# EAGLE design PixelController_V04 (EAGLE 8.0.0)
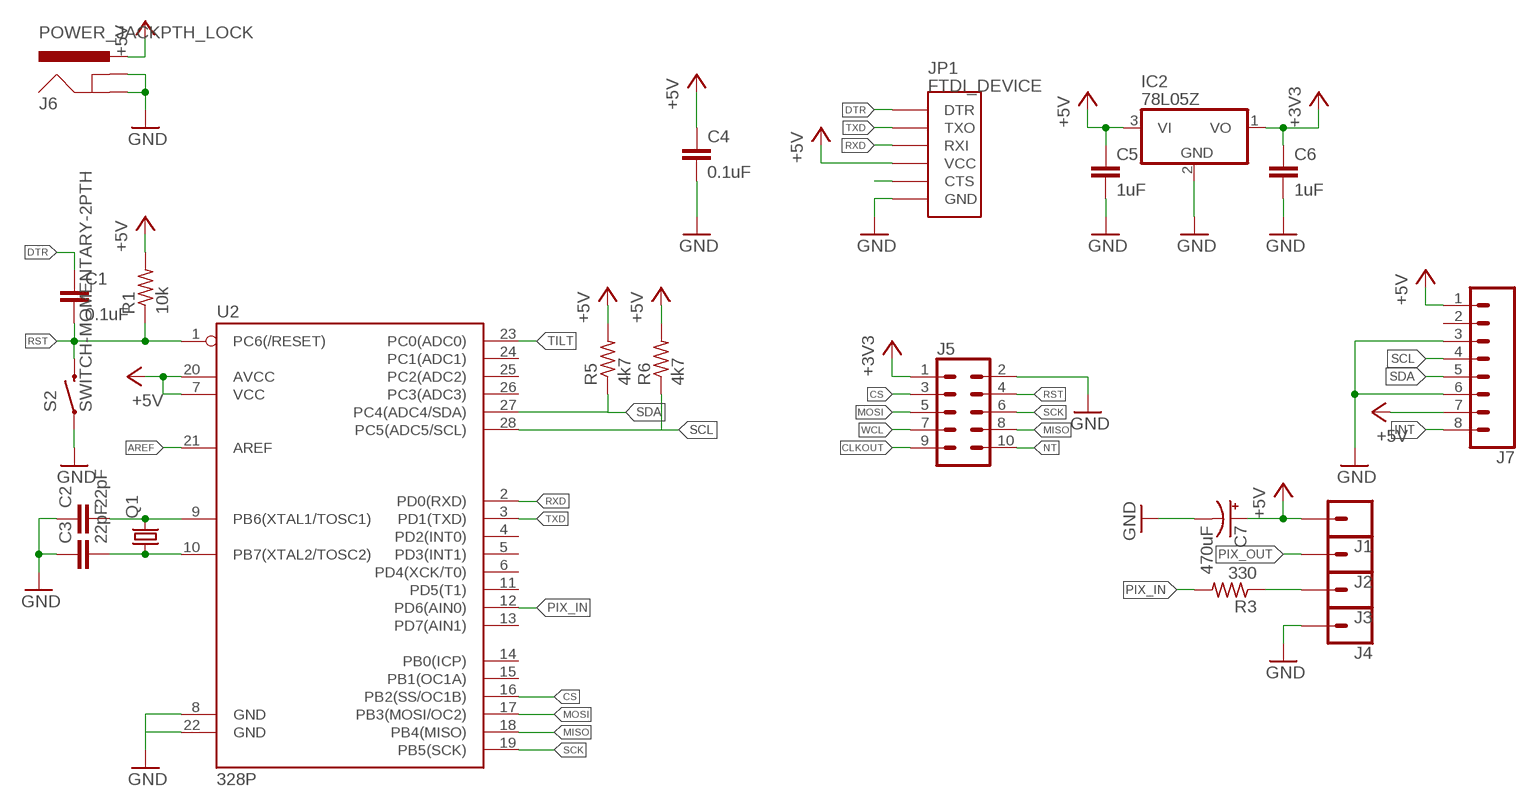
[diagram p0: schematic, sheet 1]

## Parts
C1  0.1uF  C-EU050-025X075  [C050-025X075]
C2  22pF  C-EU050-024X044  [C050-024X044]
C3  22pF  C-EU050-024X044  [C050-024X044]
C4  0.1uF  C-EU050-025X075  [C050-025X075]
C5  1uF  C-EU050-025X075  [C050-025X075]
C6  1uF  C-EU050-025X075  [C050-025X075]
C7  470uF  CPOL-USE3.5-8  [E3,5-8]
IC2  78L05Z  [TO92]
J1  CONN_01  [1X01]
J2  CONN_01  [1X01]
J3  CONN_01  [1X01]
J4  CONN_01  [1X01]
J5  CONN_05X2PTH  [2X5]
J6  POWER_JACKPTH_LOCK  [POWER_JACK_PTH_LOCK]
J7  CONN_08"  [1X08@1]
JP1  FTDI_DEVICE  [FTDI_DEVICE_SIDE]
Q1  CRYSTALHC49U70  [HC49U70]
R1  10k  R-US_0204/7  [0204/7]
R3  330  R-US_0204/7  [0204/7]
R5  4k7  R-US_0204/7  [0204/7]
R6  4k7  R-US_0204/7  [0204/7]
S2  SWITCH-MOMENTARY-2PTH  [TACTILE-PTH]
U2  328P  ATMEGA328P_PDIP  [DIP28]

## Nets
+3V3: C6.1 IC2.1(VO) J5.1
+5V: C4.1 C5.1 C7.+ IC2.3(VI) J1.1 J6.PWR J7.1 J7.7 JP1.P$4(VCC) R1.2 R5.2 R6.2 U2.7(VCC) U2.20(AVCC)
AREF: U2.21(AREF)
CLKOUT: J5.9
CS: J5.3 U2.16(PB2(SS/OC1B))
DTR: C1.1 JP1.P$1(DTR)
GND: C2.1 C3.1 C4.2 C5.2 C6.2 C7.- IC2.2(GND) J4.1 J5.2 J6.GND J6.GNDBREAK J7.3 J7.6 JP1.P$6(GND) S2.1 U2.8(GND) U2.22(GND)
INT: J7.8
MISO: J5.8 U2.18(PB4(MISO))
MOSI: J5.5 U2.17(PB3(MOSI/OC2))
N$2: C3.2 Q1.1 U2.10(PB7(XTAL2/TOSC2))
N$3: C2.2 Q1.2 U2.9(PB6(XTAL1/TOSC1))
N$7: J3.1 R3.1
N$8: JP1.P$5(CTS)
NT: J5.10
PIX_IN: R3.2 U2.12(PD6(AIN0))
PIX_OUT: J2.1
RST: C1.2 J5.4 R1.1 S2.3 U2.1(PC6(/RESET))
RXD: JP1.P$3(RXI) U2.2(PD0(RXD))
SCK: J5.6 U2.19(PB5(SCK))
SCL: J7.4 R6.1 U2.28(PC5(ADC5/SCL))
SDA: J7.5 R5.1 U2.27(PC4(ADC4/SDA))
TILT: U2.23(PC0(ADC0))
TXD: JP1.P$2(TXO) U2.3(PD1(TXD))
WCL: J5.7
Unconnected: J7.2 U2.4(PD2(INT0)) U2.5(PD3(INT1)) U2.6(PD4(XCK/T0)) U2.11(PD5(T1)) U2.13(PD7(AIN1)) U2.14(PB0(ICP)) U2.15(PB1(OC1A)) U2.24(PC1(ADC1)) U2.25(PC2(ADC2)) U2.26(PC3(ADC3))

## Library data of the parts
C1-C6 = rcl:C-EU: CAPACITOR, European symbol
C7 = rcl:CPOL-US: POLARIZED CAPACITOR, American symbol
IC2 = linear:78*: Positive VOLTAGE REGULATOR Source: http://cache.national.com/ds/LM/LM78L05.pdf http://www.fairchildsemi.com/ds/LM/LM7805.pdf
J1-J4 = SparkFun-Connectors:CONN_01: Single connection point. Often used as Generic Header-pin footprint for 0.1 inch spaced/style header connections On any of the 0.1 inch spaced packages, you can populate with these: Break Away Headers - Straight <https://www.sparkfun.com/products/116> (PRT-00116) Break Away Male Headers - Right Angle <https://www.sparkfun.com/products/553> (PRT-00553) Female Headers <https://www.sparkfun.com/products/115> (PRT-00115) Break Away Headers - Machine Pin <https://www.sparkfun.com/products/117> (PRT-00117) Break Away Female Headers - Swiss Machine Pin <https://www.sparkfun.com/products/743> (PRT-00743) This device is also useful as a general connection point to wire up your design to another part of your project. Our various solder wires solder well into these plated through hole pads. Hook-Up Wire - Assortment (Stranded, 22 AWG) <https://www.sparkfun.com/products/11375> (PRT-11375) Hook-Up Wire - Assortment (Solid Core, 22 AWG) <https://www.sparkfun.com/products/11367> (PRT-11367) View the entire wire category on our website here <https://www.sparkfun.com/categories/141> Special notes: SMTSO-256-ET is a "flush mount" nut for a 4-40 screw. We mostly use this on specialty testbeds; it is a nice way to connect hardware to your PCB at an adjustable hieght. Also note, the SNAP packages are for using a snappable style connector. We sell a baggie of snaps and they are also used on two LilyPad designs: Snap Assortment - 30 pack (male and female) <https://www.sparkfun.com/products/11347> (DEV-11347) LilyPad Arduino SimpleSnap <https://www.sparkfun.com/products/10941> (DEV-10941) LilyPad SimpleSnap Protoboard <https://www.sparkfun.com/products/10940> (DEV-10940)
J5 = SparkFun-Connectors:CONN_05X2: Multi connection point. Often used as Generic Header-pin footprint for 0.1 inch spaced/style header connections For AVR SPI programming port, see special device with nice symbol: "AVR_SPI_PROG_5x2.dev" You can populate with any combo of single row headers, but if you'd like an exact match, check these: 2x5 AVR ICSP Male Header <https://www.sparkfun.com/products/778> (PRT-00778) 2x5 Pin Shrouded Header <https://www.sparkfun.com/products/8506> (PRT-08506) On any of the 0.1 inch spaced packages, you can populate with these: Break Away Headers - Straight <https://www.sparkfun.com/products/116> (PRT-00116) Break Away Male Headers - Right Angle <https://www.sparkfun.com/products/553> (PRT-00553) Female Headers <https://www.sparkfun.com/products/115> (PRT-00115) Break Away Headers - Machine Pin <https://www.sparkfun.com/products/117> (PRT-00117) Break Away Female Headers - Swiss Machine Pin <https://www.sparkfun.com/products/743> (PRT-00743) Special note: the shrouded connector mates well with our 5x2 ribbon cables: 2x5 Pin IDC Ribbon Cable <https://www.sparkfun.com/products/8535> (PRT-08535); PROD_ID: CONN-08499; SF_ID: PRT-0778
J6 = SparkFun-Connectors:POWER_JACK: Power Jack Connector This is the standard 5.5mm barrel jack for power. The PTH is the most common, proven, reliable, footprint. The Slot footprint only works if the mill layer is transmitted to the PCB fab house so be warned. Here are the connectors we sell at SparkFun: DC Barrel Power Jack/Connector <https://www.sparkfun.com/products/119> (PRT-00119) DC Barrel Power Jack/Connector (SMD) <https://www.sparkfun.com/products/12748> (PRT-12748) DC Barrel Jack Adapter - Breadboard Compatible <https://www.sparkfun.com/products/10811> (PRT-10811) It is used on this SparkFun product (and many, many others): SparkFun RedBoard - Programmed with Arduino <https://www.sparkfun.com/products/12757> (DEV-12757) Also, if you need a mating power supply or connector, please check these out: Wall Adapter Power Supply - 9VDC 650mA <https://www.sparkfun.com/products/298> (TOL-00298) DC Barrel Jack Adapter - Male <https://www.sparkfun.com/products/10287> (PRT-10287); PROD_ID: CONN-08197; SF_ID: PRT-00119
J7 = SparkFun-Connectors:CONN_08: Multi connection point. Often used as Generic Header-pin footprint for 0.1 inch spaced/style header connections On any of the 0.1 inch spaced packages, you can populate with these: Break Away Headers - Straight <https://www.sparkfun.com/products/116> (PRT-00116) Break Away Male Headers - Right Angle <https://www.sparkfun.com/products/553> (PRT-00553) Female Headers <https://www.sparkfun.com/products/115> (PRT-00115) Break Away Headers - Machine Pin <https://www.sparkfun.com/products/117> (PRT-00117) Break Away Female Headers - Swiss Machine Pin <https://www.sparkfun.com/products/743> (PRT-00743) Arduino Stackable Header - 8 Pin <https://www.sparkfun.com/products/9279> (PRT-09279) For SCREWTERMINALS and SPRING TERMINALS visit here: Screw Terimnals on SparkFun.com <https://www.sparkfun.com/search/results?term=Screw+Terminals> (5mm/3.5mm/2.54mm spacing) This device is also useful as a general connection point to wire up your design to another part of your project. Our various solder wires solder well into these plated through hole pads. Hook-Up Wire - Assortment (Stranded, 22 AWG) <https://www.sparkfun.com/products/11375> (PRT-11375) Hook-Up Wire - Assortment (Solid Core, 22 AWG) <https://www.sparkfun.com/products/11367> (PRT-11367) View the entire wire category on our website here <https://www.sparkfun.com/categories/141> Special notes: Molex polarized connector foot print use with SKU : PRT-08231 with associated crimp pins and housings. 1MM SMD Version SKU: PRT-10208 NOTES ON THE VARIANTS LOCK and LOCK_LONGPADS... This footprint was designed to help hold the alignment of a through-hole component (i.e. 6-pin header) while soldering it into place. You may notice that each hole has been shifted either up or down by 0.005 of an inch from it's more standard position (which is a perfectly straight line). This slight alteration caused the pins (the squares in the middle) to touch the edges of the holes. Because they are alternating, it causes a "brace" to hold the component in place. 0.005 has proven to be the perfect amount of "off-center" position when using our standard breakaway headers. Although looks a little odd when you look at the bare footprint, once you have a header in there, the alteration is very hard to notice. Also,if you push a header all the way into place, it is covered up entirely on the bottom side.; PROD_ID: CONN-08438
JP1 = SparkFun-Connectors:FTDI_DEVICE: Connector which mates to FTDI basic or FTDI cable.
Q1 = adafruit:CRYSTAL: CRYSTAL; OC_FARNELL: unknown; OC_NEWARK: unknown
R1 R3 R5 R6 = rcl:R-US_: RESISTOR, American symbol
S2 = SparkFun-Electromechanical:SWITCH-MOMENTARY-2: Various NO switches- pushbuttons, reed, etc
U2 = SparkFun-IC-Microcontroller:ATMEGA328P_PDIP: Atmel 328P Through hole ATMEGA328P uC used in the Arduino 32kb flash, 1k EEPROM, 2k SRAM Datasheet <http://www.sparkfun.com/datasheets/Components/SMD/ATMega328.pdf> SparkFun Products Storefront component: AVR 28 Pin 20MHz 32K 6A/D - ATMega328P <https://www.sparkfun.com/products/9061> (COM-09061) SparkFun Simon Says - Through-Hole Soldering Kit <https://www.sparkfun.com/products/10547> (KIT-10547) SparkFun Learn to Solder - Simon Says <https://www.sparkfun.com/products/13708> (KIT-13708) SparkFun BigTime Watch Kit <https://www.sparkfun.com/products/11734> (KIT-11734) SparkFun ClockIt <https://www.sparkfun.com/products/10930> (KIT-10930) SparkFun Serial Enabled LCD Kit <https://www.sparkfun.com/products/10097> (LCD-10097) SparkFun Simon Tilts - Through Hole Soldering Kit <https://www.sparkfun.com/products/12634> (KIT-12634) SparkFun Frequency Counter Kit <https://www.sparkfun.com/products/10140> (KIT-10140) FabFM Radio Kit <https://www.sparkfun.com/products/11043> (KIT-11043) SparkFun Binary Blaster Kit <https://www.sparkfun.com/products/12037> (KIT-12037) SparkFun Metro-Gnome <https://www.sparkfun.com/products/9236> (KIT-09236) ATmega328 with Arduino Optiboot (Uno) <https://www.sparkfun.com/products/10524> (DEV-10524); PROD_ID: IC-09136

## Board
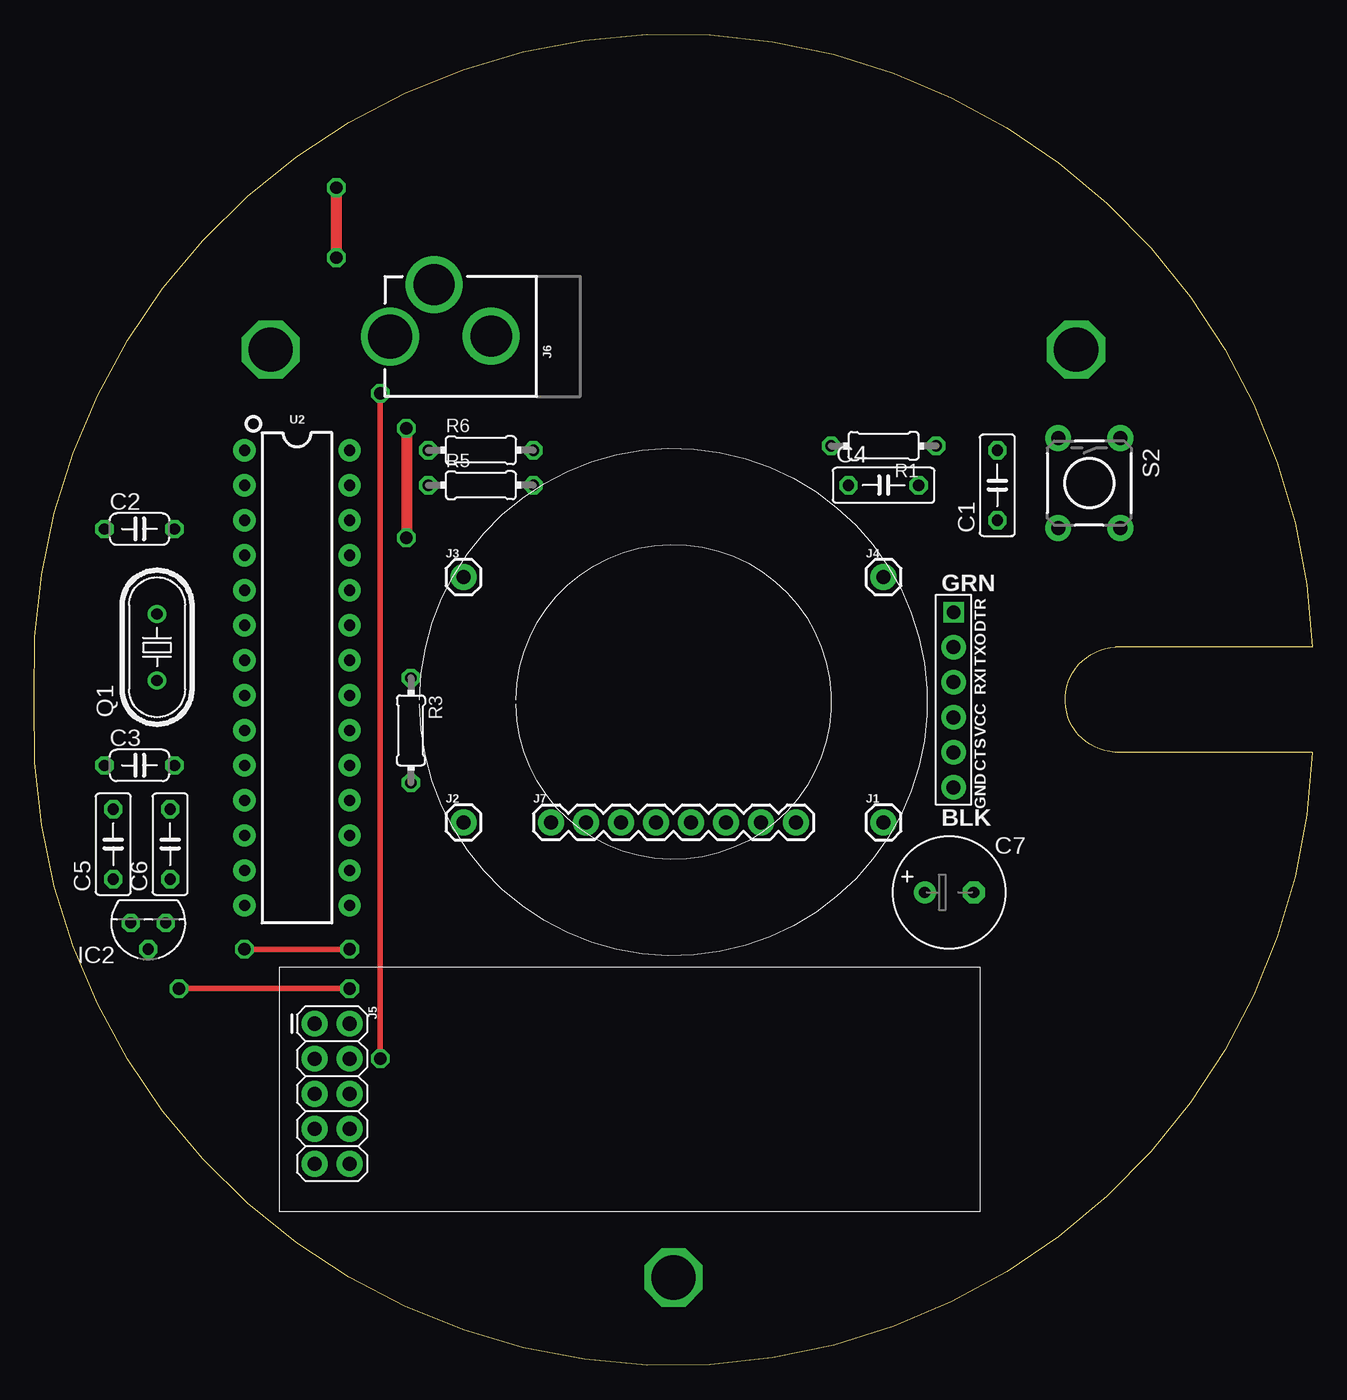
[diagram p1: board, top side]
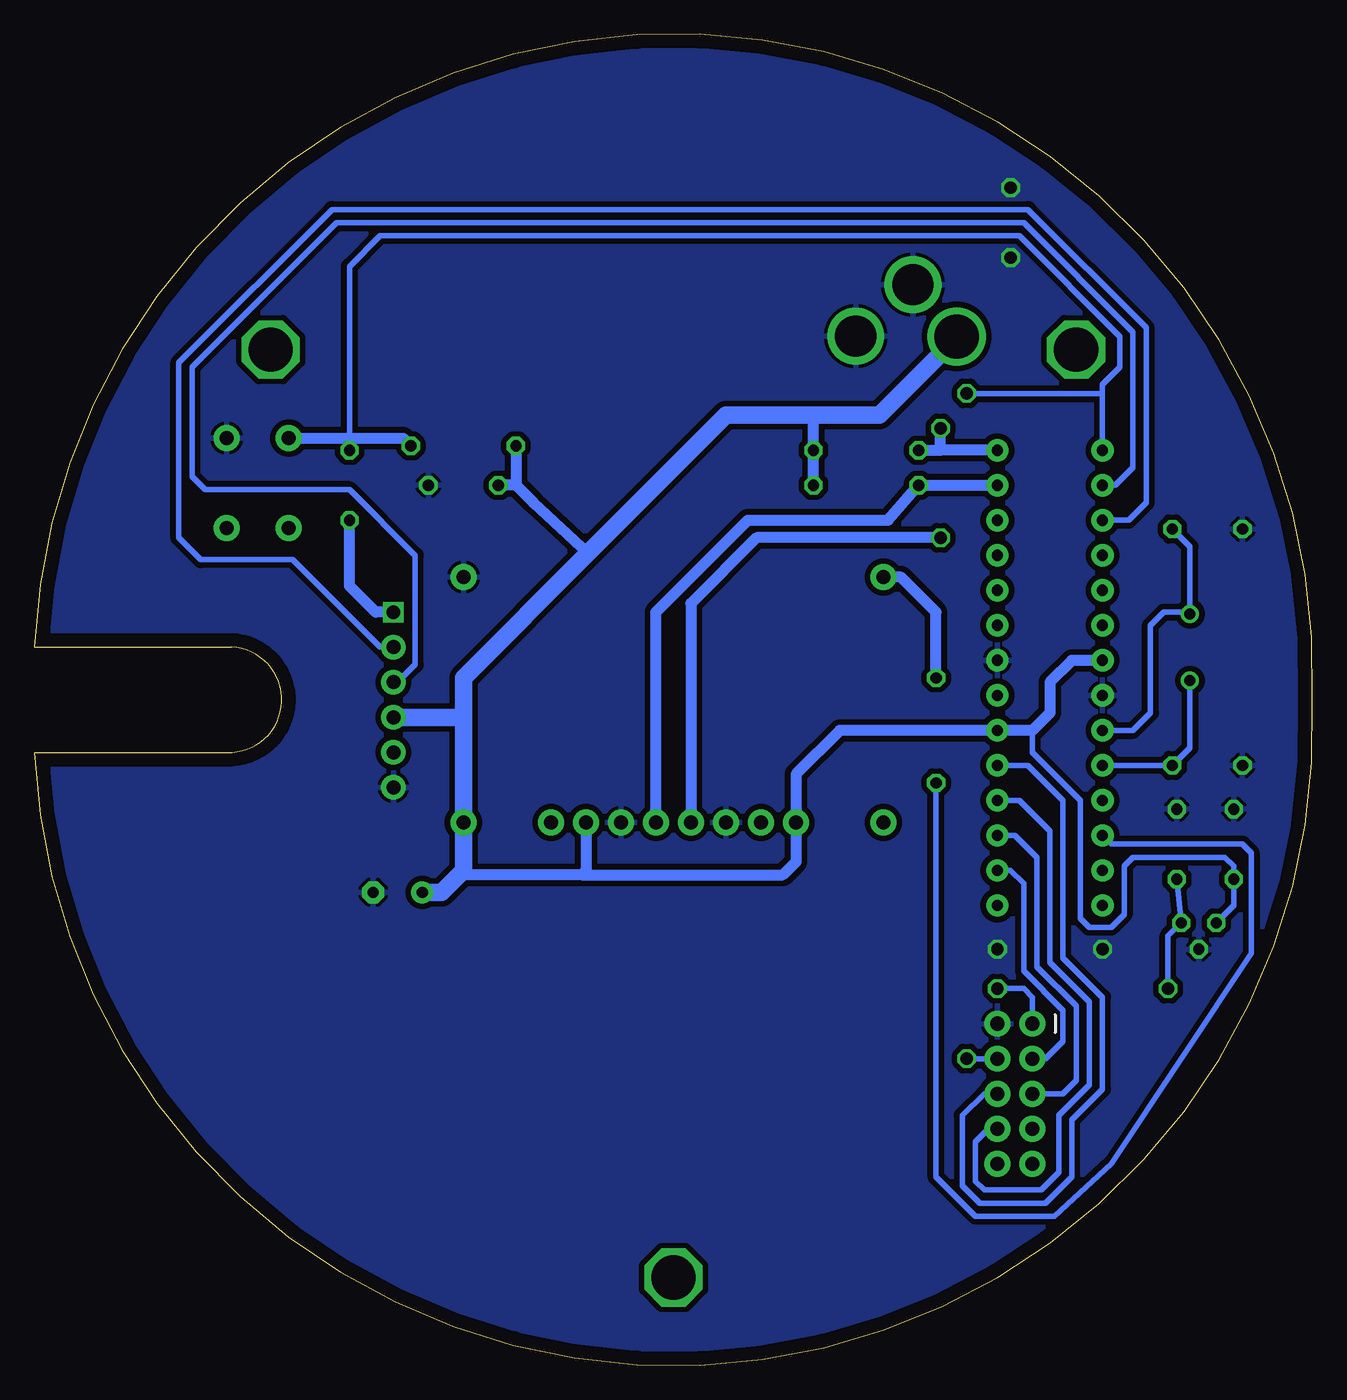
[diagram p2: board, bottom side, seen from below]

Size 92.71 x 96.52 mm. Coordinates in mm from the lower left corner, seen from the top.
Outline: 92.71,52.07 78.42,52.07 arc180 78.74,44.45 92.71,44.45 arc-180 0,48.26 arc-180 92.71,52.07
Copper layers (1*16): Top 0.035mm / dielectric 1.5mm / Bottom 0.035mm
Design rules "default": minimum track width 10mil, minimum drill 24mil, track to track 8mil, track to pad 8mil, pad to pad 8mil, via to via 8mil, smd to smd 8mil, copper to edge 40mil, drill to drill 8mil, minimum pad ring 10mil, minimum via ring 8mil, stop-mask expansion 4mil, vias tented up to drill 0mil, thermal gap 10mil

### Footprints (pad centres in the part's own frame; a part is rotated, then mirrored left to right if it is on the bottom)
C050-025X075 = drill 0.813 octagon: 1 -2.54,0; 2 2.54,0
C050-024X044 = drill 0.813 octagon: 1 -2.54,0; 2 2.54,0
E3,5-8 = drill 0.813 pad 1.6: + -1.778,0 | drill 0.813 pad 1.6 octagon: - 1.778,0
TO92 = drill 0.813 octagon: 1 -1.27,0; 2 0,1.905; 3 1.27,0
1X01 = drill 1.016 pad 1.88: 1 0,0
2X5 = drill 1.016 pad 1.88: 1 0,0; 2 0,2.54; 3 2.54,0; 4 2.54,2.54; 5 5.08,0; 6 5.08,2.54; 7 7.62,0; 8 7.62,2.54; 9 10.16,0; 10 10.16,2.54
POWER_JACK_PTH_LOCK = drill 2.997 pad 4.115: GND 0.025,6.557; GNDBREAK 3.762,10.7 | drill 3.2 pad 4.115: PWR 0,13.878
1X08@1 = drill 1.016 pad 1.88: 1 0,0; 2 2.54,0; 3 5.08,0; 4 7.62,0; 5 10.16,0; 6 12.7,0; 7 15.24,0; 8 17.78,0
FTDI_DEVICE_SIDE = drill 1 square: P$1 -6.35,0 | drill 1.016 pad 1.778: P$2 -3.81,0; P$3 -1.27,0; P$4 1.27,0; P$5 3.81,0; P$6 6.35,0
HC49U70 = drill 0.813: 1 -2.413,0; 2 2.413,0
0204/7 = drill 0.813 octagon: 1 -3.81,0; 2 3.81,0
TACTILE-PTH = drill 1.016 pad 1.88: 1 -3.251,2.261; 2 3.251,2.261; 3 -3.251,-2.261; 4 3.251,-2.261
DIP28 = drill 0.813 pad 1.626: 1 -16.51,-3.81; 2 -13.97,-3.81; 3 -11.43,-3.81; 4 -8.89,-3.81; 5 -6.35,-3.81; 6 -3.81,-3.81; 7 -1.27,-3.81; 8 1.27,-3.81; 9 3.81,-3.81; 10 6.35,-3.81; 11 8.89,-3.81; 12 11.43,-3.81; 13 13.97,-3.81; 14 16.51,-3.81; 15 16.51,3.81; 16 13.97,3.81; 17 11.43,3.81; 18 8.89,3.81; 19 6.35,3.81; 20 3.81,3.81; 21 1.27,3.81; 22 -1.27,3.81; 23 -3.81,3.81; 24 -6.35,3.81; 25 -8.89,3.81; 26 -11.43,3.81; 27 -13.97,3.81; 28 -16.51,3.81

### Placement (x,y rotation side)
C1  69.85,63.82 90 top
C2  7.62,60.64 0 top
C3  7.62,43.5 0 top
C4  61.59,63.82 0 top
C5  5.71,37.78 90 top
C6  9.84,37.78 90 top
C7  66.36,34.29 0 top
IC2  8.26,32.07 180 top
J1  61.59,39.37 0 top
J2  31.12,39.37 0 top
J3  31.12,57.15 0 top
J4  61.59,57.15 0 top
J5  20.32,24.76 270 top
J6  39.69,74.61 90 top
J7  37.46,39.37 0 top
JP1  66.67,48.26 270 top
Q1  8.89,52.07 90 top
R1  61.59,66.67 180 top
R3  27.3,46.04 270 top
R5  32.38,63.82 0 top
R6  32.38,66.36 0 top
S2  76.52,63.98 270 top
U2  19.05,49.85 270 top

### Tracks (layer width: path | path; a pad name or v marks a point on that pad's centre or on a via)
+3V3  (via drill 0.9)
  Top 0.406: v22.86,27.3 v10.48,27.3
  Bottom 0.406: C6.1 IC2.1 10.48,31.11 v10.48,27.3 | J5.1 20.32,26.67 20.95,27.3 v22.86,27.3
+5V
  Bottom 0.406: IC2.3 5.71,33.34 C5.1 5.71,36.19 6.35,36.83 13.02,36.83 13.65,36.19 13.65,32.7 14.61,31.75 16.19,31.75 16.83,32.38 16.83,40.96 20.32,44.45 20.32,46.04
  Bottom 0.813: 57.78,63.82 C4.1 | 57.78,63.82 56.52,62.55 52.55,58.9 | R5.2 R6.2 36.2,68.9 | 53.02,35.56 38.42,35.56 37.46,36.51 J7.1 37.46,42.86 34.29,46.04 U2.20 20.32,46.04 19.05,47.31 19.05,49.53 17.46,51.12 U2.7 | 53.02,35.56 61.28,35.56 61.59,35.88 | J7.7 52.7,35.88 53.02,35.56 | R1.2 57.78,63.82
  Bottom 1.27: 61.59,46.99 J1.1 61.59,35.88 63.18,34.29 C7.+ | 61.59,46.99 JP1.P$4 | J6.PWR 25.81,74.52 31.43,68.9 36.2,68.9 42.55,68.9 52.55,58.9 61.59,49.85 61.59,46.99
CS
  Bottom 0.406: J5.3 19.37,22.22 18.1,23.49 18.1,25.72 20.95,28.57 20.95,34.92 21.91,35.88 U2.16
DTR
  Bottom 0.813: JP1.P$1 67.94,54.61 69.85,56.51 C1.1
GND  (via drill 0.9)
  Top 0.406: v15.24,30.16 v22.86,30.16
  Top 0.813: v21.91,80.33 v21.91,85.41
  pour Bottom (isolate 0.406): -1.27,52.39 arc-90 46.99,96.52 47.94,96.52 arc-90 92.71,51.75 78.11,51.75 arc90 74.93,48.58 arc90 79.38,44.13 93.03,44.13 arc-90 48.89,0 46.04,0 arc-90
MISO
  Bottom 0.406: J5.8 23.49,17.14 24.45,16.19 24.45,13.33 23.81,12.7 19.68,12.7 18.41,13.97 18.41,18.1 16.19,20.32 16.19,26.35 19.05,29.21 19.05,38.73 21.27,40.96 U2.18
MOSI
  Bottom 0.406: J5.5 18.1,19.68 17.14,20.64 17.14,26.03 20,28.89 20,36.83 21.59,38.42 U2.17
N$1  (via drill 3.2)
  other vias: 46.35,6.35
N$2
  Bottom 0.406: Q1.1 8.89,44.77 C3.2 U2.10
N$3
  Bottom 0.406: C2.2 8.89,59.37 Q1.2 9.02,54.61 10.79,54.61 11.75,53.66 11.75,47.31 13.02,46.04 U2.9
N$4  (via drill 3.2)
  other vias: 75.56,73.66
N$5  (via drill 3.2)
  other vias: 17.14,73.66
N$7
  Bottom 0.813: R3.1 27.3,54.61 29.84,57.15 J3.1
PIX_IN
  Bottom 0.406: U2.12 14.61,37.78 5.08,37.78 4.44,37.15 4.44,29.84 14.61,14.6 18.73,10.79 24.45,10.79 27.3,13.65 R3.2
RST  (via drill 0.9)
  Top 0.406: v25.08,22.22 v25.08,70.48
  Bottom 0.406: 15.24,70.48 U2.1 | 15.24,70.48 15.24,71.12 13.97,72.39 13.97,74.61 21.27,81.91 67.63,81.91 69.85,79.69 69.85,67.23 | J5.4 v25.08,22.22 | v25.08,70.48 15.24,70.48
  Bottom 0.813: S2.3 69.85,67.23 | 69.85,67.23 65.96,67.23 R1.1 | C1.2 69.85,67.23
RXD
  Bottom 0.406: JP1.P$3 66.36,49.53 65.09,50.8 65.09,58.74 69.85,63.5 80.33,63.5 81.28,64.45 81.28,72.39 70.8,82.87 20.95,82.87 13.02,74.93 13.02,65.09 14.29,63.82 U2.2
SCK
  Bottom 0.406: J5.6 23.81,19.68 25.4,18.1 25.4,13.02 24.13,11.75 19.37,11.75 17.46,13.65 17.46,17.78 15.24,20 15.24,26.67 18.1,29.53 18.1,40.96 20.64,43.5 U2.19
SCL  (via drill 0.9)
  Top 0.813: v26.99,67.94 v26.99,60.01
  Bottom 0.813: U2.28 26.99,66.36 | J7.4 45.09,55.24 40.32,60.01 v26.99,60.01 | R6.1 26.99,66.36 | 26.99,66.36 v26.99,67.94
SDA
  Bottom 0.813: U2.27 R5.1 30.8,61.28 40.96,61.28 47.62,54.61 J7.5
TXD
  Bottom 0.406: JP1.P$2 67.63,52.07 73.98,58.42 80.64,58.42 82.23,60.01 82.23,72.71 71.12,83.82 20.64,83.82 12.07,75.25 12.07,62.55 13.34,61.28 U2.3